# Altium project RaspberryPi_ComputeModule3.PrjPCB (part 2 of 2)

## Sheet RP_ComputeModule3_rev.3.0_BootSelector.SchDoc
size A4 portrait
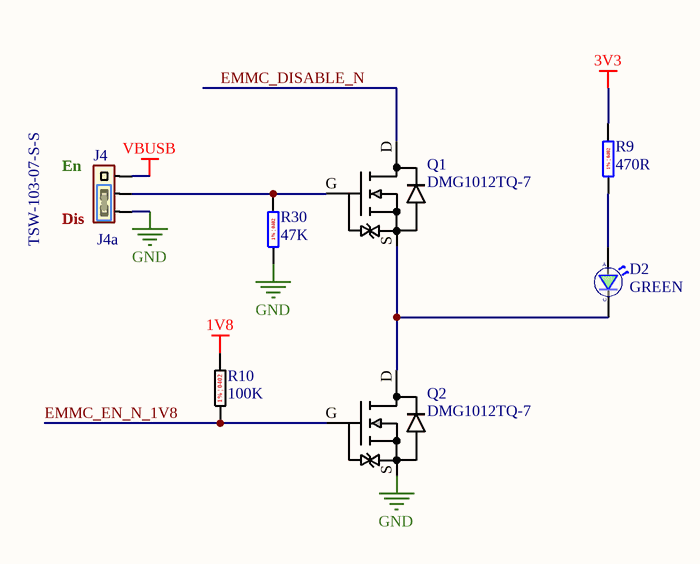
[diagram p5: RP_ComputeModule3_rev.3.0_BootSelector.SchDoc]

### Parts
D2  GREEN  [ROHM 0603 LED]
J4  TSW-103-07-S-S  [Samtec TSW-103-07-S-S]
J4a  Jumper  [Kobiconn 151-8011-E (Blue)]  (value not drawn)
Q1  DMG1012TQ-7  [Diodes SOT523]
Q2  DMG1012TQ-7  [Diodes SOT523]
R9  470R  [Vishay RES0402]
R10  100K  [RES0402]
R30  47K  [Vishay Beyschlag MCS0402]

### Nets
1V8: R10.1
3V3: R9.1
GND: J4.1 Q2.S R30.2
VBUSB: J4.3
EMMC_DISABLE_N: Q1.D
EMMC_EN_N_1V8: Q2.G R10.2
NetD2_A: D2.A R9.2
NetD2_C: D2.C Q1.S Q2.D
NetJ4_2: J4.2 Q1.G R30.1

### Notes on the sheet
- En
- Dis
- (in symbol MCS04020C4700FE000) 1% | 0402
- (in symbol MCS04020C4702FE000) 1% | 0402
- (in symbol SG73P1ETTP1003F) 1% | 0402

### Library data of the parts
D2 = SML-D12M8WT86: LED GREEN DIFFUSED 0603 SMD; Manufacturer: Rohm; Colour: Green,Yellow; Lens Colour: White,Clear,Diffused; Lens Style: Diffused,Colorless,Rectangular; Forward Current: 20mA; Forward Voltage: 2.2V; Luminous Intensity: 25mcd; Dominant Wavelength: 572nm; Number of LEDs: 1; Viewing Angle: 160°; Supplier 1: Mouser; Manufacturer Part Number: SML-D12M8WT86; Stock 1: 109326; Pricing 1: 1=0.32, 10=0.216, 50=0.216, 100=0.09, 1000=0.062, 10000=0.041 (USD); Mount: Surface Mount; Case/Package: 0603; Number of Pins: 2; Case Code (Metric): 1608; Case Code (Imperial): 0603; Min Operating Temperature: -40°C; Max Operating Temperature: 85°C; Packaging: Tape and Reel; Wavelength: 572nm; Illumination Colour: Green; Package Quantity: 1; Test Current: 20mA; Lens Transparency: Diffused; Length: 1.6mm; Height: 0.65mm; Width: 0.8mm; Radiation Hardening: No; REACH SVHC: Unknown; Lead Free: Lead Free; ComponentLink1URL: https://datasheet.ciiva.com/11774/0900766b80df3ada-11774260.pdf; ComponentLink1Description: https://datasheet.ciiva.com/11774/0900766b80df3ada-11774260.pdf; ComponentLink2URL: https://datasheet.ciiva.com/3161/sml-d1-3161419.pdf; ComponentLink2Description: https://datasheet.ciiva.com/3161/sml-d1-3161419.pdf; ComponentLink3URL: https://datasheet.ciiva.com/2110/sml-d1-2110396.pdf; ComponentLink3Description: https://datasheet.ciiva.com/2110/sml-d1-2110396.pdf; ComponentLink4URL: https://datasheet.ciiva.com/2110/sml-d1-2110397.pdf; ComponentLink4Description: https://datasheet.ciiva.com/2110/sml-d1-2110397.pdf; ComponentLink5URL: https://datasheet.ciiva.com/2110/sml-d1-2110398.pdf; ComponentLink5Description: https://datasheet.ciiva.com/2110/sml-d1-2110398.pdf
J4 = TSW-103-07-S-S: Conn Unshrouded Header HDR 3 POS 2.54mm Solder ST Thru-Hole Bulk; Manufacturer: Samtec; Number of Contacts: 3; Gender: Male; Max Current Rating: 7.6A; Max Voltage Rating (AC): 550V; Connector Type: Male Pin; Supplier 1: Digi-Key; Manufacturer Part Number: TSW-103-07-S-S; Stock 1: 950; Pricing 1: 1=1.22, 10=1.089, 100=0.8965, 500=0.70868, 1000=0.60836, 5000=0.555, 10000=0.53365 (USD); Mount: Through Hole; Contact Plating: Nickel,Gold; Contact Material: Bronze; Housing Colour: Black; Housing Material: Polyester; Colour: Black; Min Operating Temperature: -55°C; Max Operating Temperature: 125°C; Number of Rows: 1; Termination: Solder; Packaging: Bulk; Orientation: Straight; Number of Positions: 3; Package Quantity: 1; Length: 7.62mm; Pitch: 2.54mm; Depth: 2.54mm; Contact Mating Length: 0.23inch; Width: 2.54mm; Radiation Hardening: No; REACH SVHC: No SVHC; Lead Free: Lead Free; ComponentLink1URL: https://datasheet.ciiva.com/16733/htsw-th-16733894.pdf; ComponentLink1Description: https://datasheet.ciiva.com/16733/htsw-th-16733894.pdf; ComponentLink2URL: https://datasheet.ciiva.com/48561/htsw-th-48561433.pdf; ComponentLink2Description: https://datasheet.ciiva.com/48561/htsw-th-48561433.pdf; ComponentLink3URL: https://datasheet.ciiva.com/6887/tsw-xxx-xx-xxx-x-xx-xxx-mkt-6887228.pdf; ComponentLink3Description: https://datasheet.ciiva.com/6887/tsw-xxx-xx-xxx-x-xx-xxx-mkt-6887228.pdf
J4a = 151-8011-E: Headers & Wire Housings MINI JUMPER GF 6.0MM CLOSE TYPE BLUE; Manufacturer: Kobiconn; Number of Positions: 2; Pitch: 2.54mm; Supplier 1: Mouser; Manufacturer Part Number: 151-8011-E; Stock 1: 0; Contact Gender: Male; Package Quantity: 2000; ComponentLink1URL: https://datasheet.ciiva.com/5162/kc-301174-5162989.pdf; ComponentLink1Description: https://datasheet.ciiva.com/5162/kc-301174-5162989.pdf
Q1 Q2 = DMG1012TQ-7: MOSFET NCH 20V 630MA SOT523; Manufacturer: Diodes; Rds On Max: 400mR; Input Capacitance: 60.67pF; Max Power Dissipation: 280mW; Supplier 1: Mouser; Manufacturer Part Number: DMG1012TQ-7; Stock 1: 11314; Pricing 1: 1=0.34, 10=0.225, 50=0.225, 100=0.094, 1000=0.064, 10000=0.043 (USD); Mount: Surface Mount; Case/Package: SOT-523; Number of Pins: 3; Min Operating Temperature: -55°C; Max Operating Temperature: 150°C; Packaging: Tape and Reel; Drain to Source Voltage (Vdss): 20V; Continuous Drain Current (ID): 630mA; ComponentLink1URL: http://www.mouser.com/ds/2/115/ds31783-892575.pdf; ComponentLink1Description: http://www.mouser.com/ds/2/115/ds31783-892575.pdf; ComponentLink2URL: https://www.diodes.com/assets/Datasheets/ds31783.pdf; ComponentLink2Description: https://www.diodes.com/assets/Datasheets/ds31783.pdf
R9 = MCS04020C4700FE000: RES SMD 470 OHM 1% 1/10W 0402; Manufacturer: Vishay BCcomponents; Temperature Coefficient: 50ppm/°C; Max Power Dissipation: 100mW; Supplier 1: Digi-Key; Manufacturer Part Number: MCS04020C4700FE000; Stock 1: 98990; Pricing 1: 1=0.3, 10=0.254, 100=0.0993, 1000=0.04158, 2500=0.03812, 5000=0.03465 (USD); Case/Package: 0402; Contact Plating: Tin; Min Operating Temperature: -55°C; Max Operating Temperature: 125°C; Resistance: 470R; Tolerance: 1%; Composition: Thin Film; Packaging: Tape and Reel; Package Quantity: 10000; Number of Terminations: 2; Military Standard: Not; Length: 0.039inch; Height: 0.015inch; Width: 0.02inch; Depth: 0.5mm; Radiation Hardening: No; Lead Free: Lead Free; ComponentLink1URL: https://datasheet.ciiva.com/16892/mc-pro-16892843.pdf; ComponentLink1Description: https://datasheet.ciiva.com/16892/mc-pro-16892843.pdf; ComponentLink2URL: https://datasheet.ciiva.com/2569/mc-pro-2569740.pdf; ComponentLink2Description: https://datasheet.ciiva.com/2569/mc-pro-2569740.pdf; ComponentLink3URL: https://datasheet.ciiva.com/8901/mc-pro-8901326.pdf; ComponentLink3Description: https://datasheet.ciiva.com/8901/mc-pro-8901326.pdf
R10 = SG73P1ETTP1003F: Thick Film Resistors - SMD 0.125W 100Kohm 1% 200ppm; Manufacturer: KOA Speer; Resistance: 100kR; Power Rating: 125mW; Voltage Rating: 200V; Temperature Coefficient: 200ppm/°C; Voltage Rating (DC): 50V; Supplier 1: Mouser; Manufacturer Part Number: SG73P1ETTP1003F; Stock 1: 17094; Pricing 1: 1=0.24, 10=0.24, 50=0.053, 100=0.041, 1000=0.03, 10000=0.018 (USD); Case/Package: 0402; Case Code (Imperial): 0402; Case Code (Metric): 1005; Min Operating Temperature: -55°C; Max Operating Temperature: 155°C; Tolerance: 1%; Packaging: Tape and Reel; Termination: SMD/SMT; ComponentLink1URL: https://datasheet.ciiva.com/5567/sg73-5567782.pdf; ComponentLink1Description: https://datasheet.ciiva.com/5567/sg73-5567782.pdf
R30 = MCS04020C4702FE000: Res Thin Film 0402 47K Ohm 1% 1/16W ±50ppm/C Molded SMD Paper T/R; Manufacturer: Vishay BCcomponents; Resistance: 47kR; Temperature Coefficient: 50ppm/°C; Power Rating: 100mW; Voltage Rating: 50V; Supplier 1: Mouser; Manufacturer Part Number: MCS04020C4702FE000; Stock 1: 7724; Pricing 1: 1=0.11, 10=0.11, 50=0.076, 100=0.065, 1000=0.054, 10000=0.04 (USD); Case/Package: 0402; Contact Plating: Tin; Case Code (Metric): 1005; Case Code (Imperial): 0402; Min Operating Temperature: -55°C; Max Operating Temperature: 125°C; Tolerance: 1%; Composition: Thin Film; Packaging: Tape and Reel; Military Standard: Not; Voltage Rating (DC): 50V; Length: 1mm; Depth: 0.5mm; Width: 500um; Radiation Hardening: No; REACH SVHC: No SVHC; Lead Free: Lead Free; ComponentLink1URL: https://datasheet.ciiva.com/17178/mc-pro-17178488.pdf; ComponentLink1Description: https://datasheet.ciiva.com/17178/mc-pro-17178488.pdf; ComponentLink2URL: https://datasheet.ciiva.com/8900/mc-pro-8900138.pdf; ComponentLink2Description: https://datasheet.ciiva.com/8900/mc-pro-8900138.pdf

## Sheet RP_ComputeModule3_rev.3.0_Displays.SchDoc
size A4 portrait
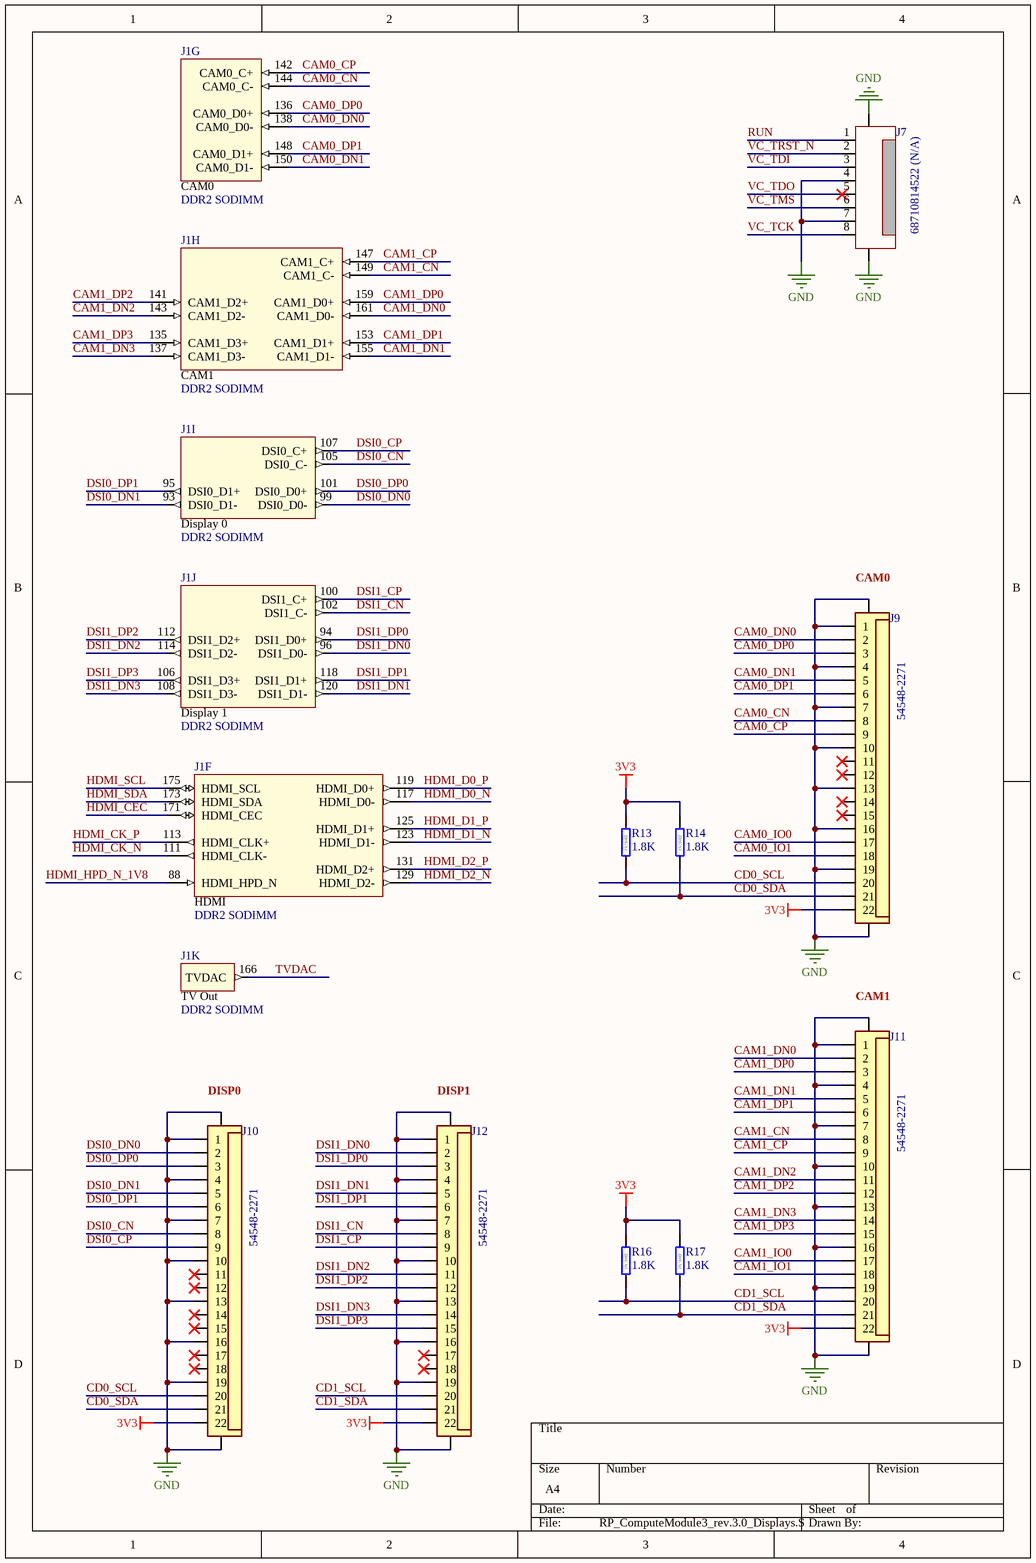
[diagram p6: RP_ComputeModule3_rev.3.0_Displays.SchDoc]

### Parts
J1  DDR2 SODIMM  [TE 1473005-4 (DDR2 SO-DIMM)]  (parts F,G,H,I,J,K of 14)
J7  68710814522 (N/A)  [WE 68710814522 N/A]  (no BOM)
J9  54548-2271  [Molex 54548-2271]
J10  54548-2271  [Molex 54548-2271]
J11  54548-2271  [Molex 54548-2271]
J12  54548-2271  [Molex 54548-2271]
R13  1.8K  [RES0402]
R14  1.8K  [RES0402]
R16  1.8K  [RES0402]
R17  1.8K  [RES0402]

### Nets
3V3: J9.22 J10.22 J11.22 J12.22 R13.1 R14.1 R16.1 R17.1
GND: J7.4 J7.7 J7.9 J7.10 J9.1 J9.4 J9.7 J9.10 J9.13 J9.16 J9.19 J9.G1 J9.G2 J10.1 J10.4 J10.7 J10.10 J10.13 J10.16 J10.19 J10.G1 J10.G2 J11.1 J11.4 J11.7 J11.10 J11.13 J11.16 J11.19 J11.G1 J11.G2 J12.1 J12.4 J12.7 J12.10 J12.13 J12.16 J12.19 J12.G1 J12.G2
CAM0_CN: J1.144(CAM0_C-) J9.8
CAM0_CP: J1.142(CAM0_C+) J9.9
CAM0_DN0: J1.138(CAM0_D0-) J9.2
CAM0_DN1: J1.150(CAM0_D1-) J9.5
CAM0_DP0: J1.136(CAM0_D0+) J9.3
CAM0_DP1: J1.148(CAM0_D1+) J9.6
CAM0_IO0: J9.17
CAM0_IO1: J9.18
CAM1_CN: J1.149(CAM1_C-) J11.8
CAM1_CP: J1.147(CAM1_C+) J11.9
CAM1_DN0: J1.161(CAM1_D0-) J11.2
CAM1_DN1: J1.155(CAM1_D1-) J11.5
CAM1_DN2: J1.143(CAM1_D2-) J11.11
CAM1_DN3: J1.137(CAM1_D3-) J11.14
CAM1_DP0: J1.159(CAM1_D0+) J11.3
CAM1_DP1: J1.153(CAM1_D1+) J11.6
CAM1_DP2: J1.141(CAM1_D2+) J11.12
CAM1_DP3: J1.135(CAM1_D3+) J11.15
CAM1_IO0: J11.17
CAM1_IO1: J11.18
CD0_SCL: J9.20 J10.20 R13.2
CD0_SDA: J9.21 J10.21 R14.2
CD1_SCL: J11.20 J12.20 R16.2
CD1_SDA: J11.21 J12.21 R17.2
DSI0_CN: J1.105(DSI0_C-) J10.8
DSI0_CP: J1.107(DSI0_C+) J10.9
DSI0_DN0: J1.99(DSI0_D0-) J10.2
DSI0_DN1: J1.93(DSI0_D1-) J10.5
DSI0_DP0: J1.101(DSI0_D0+) J10.3
DSI0_DP1: J1.95(DSI0_D1+) J10.6
DSI1_CN: J1.102(DSI1_C-) J12.8
DSI1_CP: J1.100(DSI1_C+) J12.9
DSI1_DN0: J1.96(DSI1_D0-) J12.2
DSI1_DN1: J1.120(DSI1_D1-) J12.5
DSI1_DN2: J1.114(DSI1_D2-) J12.11
DSI1_DN3: J1.108(DSI1_D3-) J12.14
DSI1_DP0: J1.94(DSI1_D0+) J12.3
DSI1_DP1: J1.118(DSI1_D1+) J12.6
DSI1_DP2: J1.112(DSI1_D2+) J12.12
DSI1_DP3: J1.106(DSI1_D3+) J12.15
HDMI_CEC: J1.171(HDMI_CEC)
HDMI_CK_N: J1.111(HDMI_CLK-)
HDMI_CK_P: J1.113(HDMI_CLK+)
HDMI_D0_N: J1.117(HDMI_D0-)
HDMI_D0_P: J1.119(HDMI_D0+)
HDMI_D1_N: J1.123(HDMI_D1-)
HDMI_D1_P: J1.125(HDMI_D1+)
HDMI_D2_N: J1.129(HDMI_D2-)
HDMI_D2_P: J1.131(HDMI_D2+)
HDMI_HPD_N_1V8: J1.88(HDMI_HPD_N)
HDMI_SCL: J1.175(HDMI_SCL)
HDMI_SDA: J1.173(HDMI_SDA)
RUN: J7.1
TVDAC: J1.166(TVDAC)
VC_TCK: J7.8
VC_TDI: J7.3
VC_TDO: J7.5
VC_TMS: J7.6
VC_TRST_N: J7.2

Not connected (* = marked no-connect by the designer): J9 11* 12* 14* 15*; J10 11* 12* 14* 15* 17* 18*; J12 17* 18*

### Notes on the sheet
- (near J9) CAM0
- (near J11) CAM1
- (near J10) DISP0
- (near J12) DISP1
- (in symbol 1473005-4, part F) HDMI
- (in symbol 1473005-4, part G) CAM0
- (in symbol 1473005-4, part H) CAM1
- (in symbol 1473005-4, part I) Display 0
- (in symbol 1473005-4, part J) Display 1
- (in symbol 1473005-4, part K) TV Out
- (in symbol RK73H1ETTP1801F) 1% | 0402

### Library data of the parts
J1 = 1473005-4: TE CONNECTIVITY / AMP         1473005-4             SOCKET IC, DIMM, DDR2, 1.8V, 200WAY; Number of Contacts: 200; Memory Type: SDRAM,DDR; Insulation Resistance: 250MR; PCB Mount Retention: With; Gender: Female; Contact Current Rating: 500mA; Circuit Application: Power; Connector System: Cable-to-Board; Sealable: No (Without); Pitch: 0.6mm; Row Spacing: 0.244inch; Stack Height: 5.2mm; Supplier 1: Digi-Key; Manufacturer: TE Connectivity; Manufacturer Part Number: 1473005-4; Stock 1: 3804; Pricing 1: 1=3.9, 10=3.744, 25=3.432, 50=3.276, 100=3.12, 250=2.73, 500=2.652, 1000=2.262, 2500=2.106 (USD); Mount: Surface Mount; Number of Pins: 200; Contact Material: Copper Alloy; Contact Plating: Gold; Housing Colour: Black; Housing Material: Thermoplastic; Insulation Material: Thermoplastic; Min Operating Temperature: -67°C; Max Operating Temperature: 185°C; Number of Rows: 2; Orientation: Right Angle; Termination: Solder; Packaging: Tray; Package Quantity: 20; Number of Positions: 200; Voltage Rating: 1.8V; Connector Type: Socket; Length: 71.5mm; Depth: 26mm; Radiation Hardening: No; ELV: Compliant; Flammability Rating: UL94 V-0; Lead Free: Lead Free; REACH SVHC: No SVHC; ComponentLink1URL: https://datasheet.ciiva.com/682/eng-cd-1473005-j2-682720.pdf; ComponentLink1Description: https://datasheet.ciiva.com/682/eng-cd-1473005-j2-682720.pdf; ComponentLink2URL: https://datasheet.ciiva.com/15171/getdatasheetpartid-99150-15171488.pdf; ComponentLink2Description: https://datasheet.ciiva.com/15171/getdatasheetpartid-99150-15171488.pdf; ComponentLink3URL: https://datasheet.ciiva.com/1105/582309-1105221.pdf; ComponentLink3Description: https://datasheet.ciiva.com/1105/582309-1105221.pdf; ComponentLink4URL: https://datasheet.ciiva.com/682/eng-cd-1473005-j2-682726.pdf; ComponentLink4Description: https://datasheet.ciiva.com/682/eng-cd-1473005-j2-682726.pdf; ComponentLink5URL: https://datasheet.ciiva.com/14156/04821302-14156311.pdf; ComponentLink5Description: https://datasheet.ciiva.com/14156/04821302-14156311.pdf; ComponentLink6URL: https://datasheet.ciiva.com/3136/eng-cd-1473005-j-3136060.pdf; ComponentLink6Description: https://datasheet.ciiva.com/3136/eng-cd-1473005-j-3136060.pdf; ComponentLink7URL: https://datasheet.ciiva.com/16380/eng-cd-1473005-j-16380909.pdf; ComponentLink7Description: https://datasheet.ciiva.com/16380/eng-cd-1473005-j-16380909.pdf; ComponentLink8URL: https://datasheet.ciiva.com/16651/eng-cd-1473005-j-16651646.pdf; ComponentLink8Description: https://datasheet.ciiva.com/16651/eng-cd-1473005-j-16651646.pdf
J7 = 68710814522_N/A: CONN FPC BOTTOM 8POS 0.50MM R/A; Manufacturer: Wurth Electronics; Actuator Material: Polymer,Liquid Crystal Polymer; Current Rating: 500mA; Voltage Rating: 50V; Number of Positions: 8; Insulation Resistance: 100MR; Gender: Male; Pitch: 0.5mm; Supplier 1: Mouser; Manufacturer Part Number: 68710814522; Stock 1: 2190; Pricing 1: 1=1.02, 10=0.991, 50=0.923, 100=0.854, 1000=0.718, 10000=0.635 (USD); Mount: Surface Mount; Contact Material: Bronze,Tin; Contact Plating: Tin; Housing Material: Liquid Crystal Polymer; Min Operating Temperature: -25°C; Max Operating Temperature: 85°C; Number of Rows: 1; Packaging: Tape and Reel; Package Quantity: 2000; Contact Location: Bottom; Termination: SMD/SMT; Number of Contacts: 8; Orientation: Straight; Length: 10.4mm; Width: 2.1mm; REACH SVHC: Unknown; Flammability Rating: UL94 V-0; ComponentLink1URL: https://datasheet.ciiva.com/670/6871xx14522-670726.pdf; ComponentLink1Description: https://datasheet.ciiva.com/670/6871xx14522-670726.pdf; ComponentLink2URL: https://datasheet.ciiva.com/670/6871xx14522-670727.pdf; ComponentLink2Description: https://datasheet.ciiva.com/670/6871xx14522-670727.pdf; ComponentLink3URL: https://datasheet.ciiva.com/670/6871xx14522-670728.pdf; ComponentLink3Description: https://datasheet.ciiva.com/670/6871xx14522-670728.pdf; ComponentLink4URL: https://datasheet.ciiva.com/14153/6871xx14522-eng-datasheet-14153886.pdf; ComponentLink4Description: https://datasheet.ciiva.com/14153/6871xx14522-eng-datasheet-14153886.pdf; ComponentLink5URL: https://datasheet.ciiva.com/29318/709082-da-01-en-smd-zif-stecker-90grad-kontakte-unten-8-29318044.pdf; ComponentLink5Description: https://datasheet.ciiva.com/29318/709082-da-01-en-smd-zif-stecker-90grad-kontakte-unten-8-29318044.pdf
J9-J12 = 0545482271: Conn FFC/FPC Connector SKT 22 POS 0.5mm Solder RA SMD Easy-On™ T/R; Manufacturer: Molex; Actuator Material: Polyphenylene; Voltage Rating: 50V; Current Rating: 500mA; Number of Positions: 22; Contact Resistance: 40mR; Wire/Cable Type: Straight; Supplier 1: Mouser; Manufacturer Part Number: 0545482271; Stock 1: 2798; Pricing 1: 1=2.25, 10=1.98, 50=1.98, 100=1.8, 1000=1.31, 10000=1.17 (USD); Mount: Surface Mount; Contact Material: Bronze; Contact Plating: Nickel,Gold; Housing Material: Polymer; Min Operating Temperature: -20°C; Max Operating Temperature: 85°C; Package Quantity: 1; Packaging: Tape and Reel; Number of Rows: 1; Termination: Solder; Orientation: Right Angle; Number of Contacts: 22; Length: 16.2mm; Pitch: 0.5mm; Depth: 5mm; Flammability Rating: UL94 V-0; ComponentLink1URL: https://datasheet.ciiva.com/3926/187910545482271-ffc-fpc-nectors-3926715.pdf; ComponentLink1Description: https://datasheet.ciiva.com/3926/187910545482271-ffc-fpc-nectors-3926715.pdf; ComponentLink2URL: https://datasheet.ciiva.com/3112/0545482271-ffc-fpc-connectors-3112285.pdf; ComponentLink2Description: https://datasheet.ciiva.com/3112/0545482271-ffc-fpc-connectors-3112285.pdf; ComponentLink3URL: https://datasheet.ciiva.com/6944/545482671-sd-6944776.pdf; ComponentLink3Description: https://datasheet.ciiva.com/6944/545482671-sd-6944776.pdf; ComponentLink4URL: https://datasheet.ciiva.com/6944/545482671-sd-6944780.pdf; ComponentLink4Description: https://datasheet.ciiva.com/6944/545482671-sd-6944780.pdf
R13 R14 R16 R17 = RK73H1ETTP1801F: Thick Film Resistors - SMD 1.8K OHM 1%; Manufacturer: KOA Speer; Resistance: 1.8kR; Power Rating: 63mW; Voltage Rating: 50V; Temperature Coefficient: 100ppm/°C; Supplier 1: Mouser; Manufacturer Part Number: RK73H1ETTP1801F; Stock 1: 3595; Pricing 1: 1=0.11, 10=0.027, 50=0.027, 100=0.007, 1000=0.005, 10000=0.004 (USD); Case/Package: 0402; Case Code (Imperial): 0402; Case Code (Metric): 1005; Min Operating Temperature: -55°C; Max Operating Temperature: 155°C; Packaging: Tape and Reel; Tolerance: 1%; Package Quantity: 10000; Composition: Thick Film; Termination: SMD/SMT; Military Standard: Not; Length: 1mm; Height: 0.35mm; Width: 0.5mm; Depth: 0.5mm; Lead Free: Lead Free; ComponentLink1URL: https://datasheet.ciiva.com/5553/rk73h-5715-5553193.pdf; ComponentLink1Description: https://datasheet.ciiva.com/5553/rk73h-5715-5553193.pdf

## Sheet RP_ComputeModule3_rev.3.0_Mechanics.SchDoc
size A4 portrait
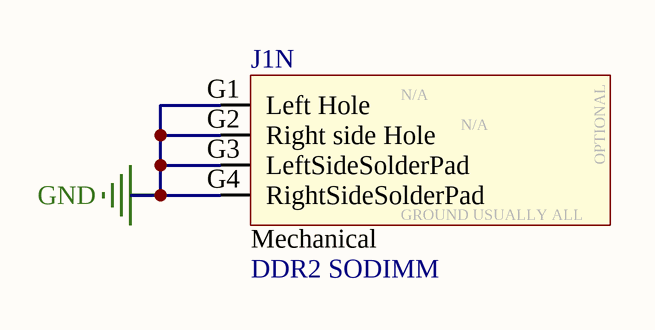
[diagram p7: RP_ComputeModule3_rev.3.0_Mechanics.SchDoc]

### Parts
J1  DDR2 SODIMM  [TE 1473005-4 (DDR2 SO-DIMM)]  (part N of 14)

### Nets
GND: J1.G1(Left_Hole) J1.G2(Right_side_Hole) J1.G3(LeftSideSolderPad) J1.G4(RightSideSolderPad)

### Notes on the sheet
- (in symbol 1473005-4, part N) N/A; OPTIONAL; GROUND USUALLY ALL; Mechanical

### Library data of the parts
J1 = 1473005-4: as J1 on sheet RP_ComputeModule3_rev.3.0_Displays; Supplier 1: Digi-Key; Manufacturer: TE Connectivity; Manufacturer Part Number: 1473005-4; Stock 1: 3804; Pricing 1: 1=3.9, 10=3.744, 25=3.432, 50=3.276, 100=3.12, 250=2.73, 500=2.652, 1000=2.262, 2500=2.106 (USD); Mount: Surface Mount; Number of Pins: 200; Contact Material: Copper Alloy; Contact Plating: Gold; Housing Colour: Black; Housing Material: Thermoplastic; Insulation Material: Thermoplastic; Min Operating Temperature: -67°C; Max Operating Temperature: 185°C; Number of Rows: 2; Orientation: Right Angle; Termination: Solder; Packaging: Tray; Package Quantity: 20; Number of Positions: 200; Voltage Rating: 1.8V; Connector Type: Socket; Length: 71.5mm; Depth: 26mm; Radiation Hardening: No; ELV: Compliant; Flammability Rating: UL94 V-0; Lead Free: Lead Free; REACH SVHC: No SVHC; ComponentLink1URL: https://datasheet.ciiva.com/682/eng-cd-1473005-j2-682720.pdf; ComponentLink1Description: https://datasheet.ciiva.com/682/eng-cd-1473005-j2-682720.pdf; ComponentLink2URL: https://datasheet.ciiva.com/15171/getdatasheetpartid-99150-15171488.pdf; ComponentLink2Description: https://datasheet.ciiva.com/15171/getdatasheetpartid-99150-15171488.pdf; ComponentLink3URL: https://datasheet.ciiva.com/1105/582309-1105221.pdf; ComponentLink3Description: https://datasheet.ciiva.com/1105/582309-1105221.pdf; ComponentLink4URL: https://datasheet.ciiva.com/682/eng-cd-1473005-j2-682726.pdf; ComponentLink4Description: https://datasheet.ciiva.com/682/eng-cd-1473005-j2-682726.pdf; ComponentLink5URL: https://datasheet.ciiva.com/14156/04821302-14156311.pdf; ComponentLink5Description: https://datasheet.ciiva.com/14156/04821302-14156311.pdf; ComponentLink6URL: https://datasheet.ciiva.com/3136/eng-cd-1473005-j-3136060.pdf; ComponentLink6Description: https://datasheet.ciiva.com/3136/eng-cd-1473005-j-3136060.pdf; ComponentLink7URL: https://datasheet.ciiva.com/16380/eng-cd-1473005-j-16380909.pdf; ComponentLink7Description: https://datasheet.ciiva.com/16380/eng-cd-1473005-j-16380909.pdf; ComponentLink8URL: https://datasheet.ciiva.com/16651/eng-cd-1473005-j-16651646.pdf; ComponentLink8Description: https://datasheet.ciiva.com/16651/eng-cd-1473005-j-16651646.pdf

## Sheet RP_ComputeModule3_rev.3.0_USB.SchDoc
size A4 portrait
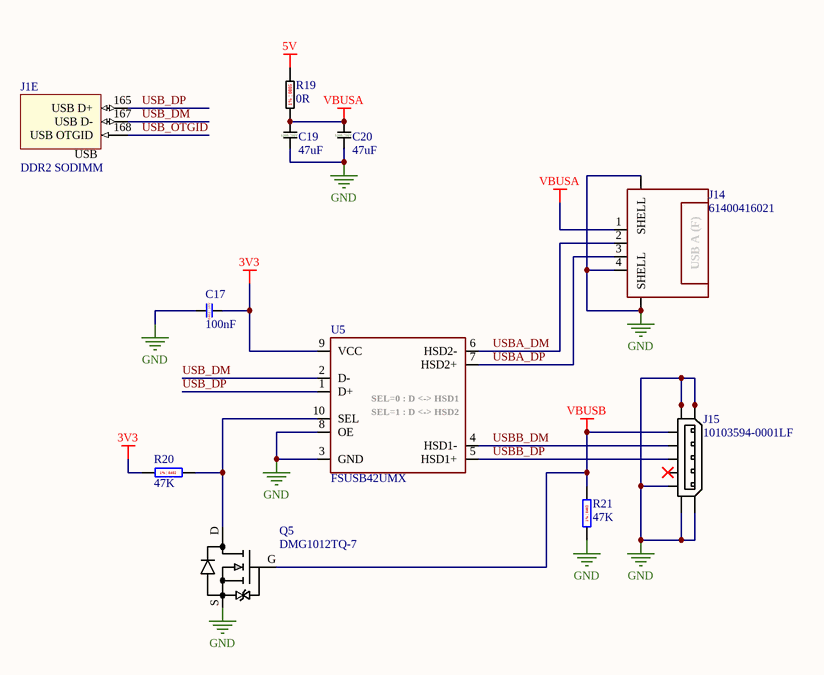
[diagram p8: RP_ComputeModule3_rev.3.0_USB.SchDoc]

### Parts
C17  100nF  [GJM 0402 C]
C19  47uF  [MURATA C1206 / CAPC3216X94N]
C20  47uF  [MURATA C1206 / CAPC3216X94N]
J1  DDR2 SODIMM  [TE 1473005-4 (DDR2 SO-DIMM)]  (part E of 14)
J14  61400416021  [WE USB connector 61400416021]
J15  10103594-0001LF  [FCI_10103594-0001LF]
Q5  DMG1012TQ-7  [Diodes SOT523]
R19  0R  [YAGEO RES0402]
R20  47K  [Vishay Beyschlag MCS0402]
R21  47K  [Vishay Beyschlag MCS0402]
U5  FSUSB42UMX  [Fairchild/OnSemi - UMLP (FSUSB42)]

### Nets
3V3: C17.1 R20.2 U5.9(VCC)
5V: R19.1
GND: C17.2 C19.1 C20.1 J14.4 J14.SHELL J14.SHELL2(SHELL) J15.1 J15.6 J15.7 J15.8 J15.9 J15.10 J15.11 Q5.S R21.2 U5.3(GND) U5.8(OE)
VBUSA: C19.2 C20.2 J14.1 R19.2
VBUSB: J15.5 Q5.G R21.1
USB_DM: J1.167(USB_D-) U5.2(D-)
USB_DP: J1.165(USB_D+) U5.1(D+)
USB_OTGID: J1.168(USB_OTGID)
USBA_DM: J14.2 U5.6(HSD2-)
USBA_DP: J14.3 U5.7(HSD2+)
USBB_DM: J15.4 U5.4(HSD1-)
USBB_DP: J15.3 U5.5(HSD1+)
NetQ5_D: Q5.D R20.1 U5.10(SEL)

Not connected (* = marked no-connect by the designer): J15 2*

### Notes on the sheet
- (in symbol 1473005-4, part E) USB
- (in symbol 61400416021) USB A (F)
- (in symbol AC0805FR-070RL) 1% | 0805
- (in symbol C3216JB1C476M160AB) 1206 | 16V
- (in symbol FSUSB42UMX) SEL=0 : D <-> HSD1; SEL=1 : D <-> HSD2
- (in symbol GRM155R71A104JA01D) 0402 | 10V
- (in symbol MCS04020C4702FE000) 1% | 0402

### Library data of the parts
C17 = GRM155R71A104JA01D: Multilayer Ceramic Capacitors MLCC - SMD/SMT 0402 0.1uF 10volts 5%; Manufacturer: Murata Electronics; Type: Chip Monolithic Ceramic Capacitor; Voltage Rating DC: 10 VDC; Capacitance - pF: 100000 pF; Dielectric: X7R; Supplier 1: Mouser; Manufacturer Part Number: GRM155R71A104JA01D; RoHS: RoHS Compliant; Category: Multilayer Ceramic Capacitors MLCC - SMD/SMT; Stock 1: 376; Pricing 1: 1=0.100, 10=0.024, 100=0.011, 500=0.008, 1000=0.006, 5000=0.005, 10000=0.004 (USD); Capacitance: 0.1 uF; Height: 0.5 mm; Length: 1 mm; Package / Case: 0402 (1005 metric); Packaging: Cut Tape; Product: General Type MLCCs; Series: GRM; Termination Style: SMD/SMT; Tolerance: 5 %; Width: 0.5 mm; Brand: Murata Electronics; Capacitance - nF: 100 nF; Case Code - in: 0402; Case Code - mm: 1005; Maximum Operating Temperature: + 125 C; Minimum Operating Temperature: - 55 C; Standard Pack Qty: 10000; RoHS - Mouser: Y; Minimum Order Quantity: 1; Reeling: True; ComponentLink1URL: https://www.mouser.com/ds/2/281/c02e-2905.pdf; ComponentLink1Description: https://www.mouser.com/ds/2/281/c02e-2905.pdf
C19 C20 = C3216JB1C476M160AB: 47µF ±20% 16V JB Ceramic Capacitor -25°C ~ 85°C Surface Mount, MLCC 1206 (3216 Metric) 0.126" L x 0.063" W (3.20mm x 1.60mm); Manufacturer: TDK; Supplier 1: Digi-Key; Manufacturer Part Number: C3216JB1C476M160AB; Stock 1: 203837; Pricing 1: 1=1.2, 10=0.949, 100=0.7116, 500=0.53762, 1000=0.47438 (USD); Mount: Surface Mount; Case/Package: 1206; Case Code (Metric): 3216; Case Code (Imperial): 1206; Dielectric Material: Ceramic; Min Operating Temperature: -25°C; Max Operating Temperature: 85°C; Package Quantity: 1; Packaging: Tape and Reel; Capacitance: 47uF; Tolerance: 20%; Voltage Rating: 16V; Termination: SMD/SMT; Composition: Ceramic; Voltage Rating (DC): 16V; Length: 0.126inch; Height: 1.6mm; Width: 0.063inch; Thickness: 0.069inch; Lead Free: Lead Free; ComponentLink1URL: https://product.tdk.com/en/products/common/pdf/mlcc_partnumber_description.pdf; ComponentLink1Description: https://product.tdk.com/en/products/common/pdf/mlcc_partnumber_description.pdf; ComponentLink2URL: http://product.tdk.com/en/catalog/datasheets/mlcc_commercial_general_en.pdf; ComponentLink2Description: http://product.tdk.com/en/catalog/datasheets/mlcc_commercial_general_en.pdf; ComponentLink3URL: http://www.mouser.com/ds/2/400/lcc_commercial_general_en-837201.pdf; ComponentLink3Description: http://www.mouser.com/ds/2/400/lcc_commercial_general_en-837201.pdf
J1 = 1473005-4: as J1 on sheet RP_ComputeModule3_rev.3.0_Displays; Supplier 1: Digi-Key; Manufacturer: TE Connectivity; Manufacturer Part Number: 1473005-4; Stock 1: 3804; Pricing 1: 1=3.9, 10=3.744, 25=3.432, 50=3.276, 100=3.12, 250=2.73, 500=2.652, 1000=2.262, 2500=2.106 (USD); Mount: Surface Mount; Number of Pins: 200; Contact Material: Copper Alloy; Contact Plating: Gold; Housing Colour: Black; Housing Material: Thermoplastic; Insulation Material: Thermoplastic; Min Operating Temperature: -67°C; Max Operating Temperature: 185°C; Number of Rows: 2; Orientation: Right Angle; Termination: Solder; Packaging: Tray; Package Quantity: 20; Number of Positions: 200; Voltage Rating: 1.8V; Connector Type: Socket; Length: 71.5mm; Depth: 26mm; Radiation Hardening: No; ELV: Compliant; Flammability Rating: UL94 V-0; Lead Free: Lead Free; REACH SVHC: No SVHC; ComponentLink1URL: https://datasheet.ciiva.com/682/eng-cd-1473005-j2-682720.pdf; ComponentLink1Description: https://datasheet.ciiva.com/682/eng-cd-1473005-j2-682720.pdf; ComponentLink2URL: https://datasheet.ciiva.com/15171/getdatasheetpartid-99150-15171488.pdf; ComponentLink2Description: https://datasheet.ciiva.com/15171/getdatasheetpartid-99150-15171488.pdf; ComponentLink3URL: https://datasheet.ciiva.com/1105/582309-1105221.pdf; ComponentLink3Description: https://datasheet.ciiva.com/1105/582309-1105221.pdf; ComponentLink4URL: https://datasheet.ciiva.com/682/eng-cd-1473005-j2-682726.pdf; ComponentLink4Description: https://datasheet.ciiva.com/682/eng-cd-1473005-j2-682726.pdf; ComponentLink5URL: https://datasheet.ciiva.com/14156/04821302-14156311.pdf; ComponentLink5Description: https://datasheet.ciiva.com/14156/04821302-14156311.pdf; ComponentLink6URL: https://datasheet.ciiva.com/3136/eng-cd-1473005-j-3136060.pdf; ComponentLink6Description: https://datasheet.ciiva.com/3136/eng-cd-1473005-j-3136060.pdf; ComponentLink7URL: https://datasheet.ciiva.com/16380/eng-cd-1473005-j-16380909.pdf; ComponentLink7Description: https://datasheet.ciiva.com/16380/eng-cd-1473005-j-16380909.pdf; ComponentLink8URL: https://datasheet.ciiva.com/16651/eng-cd-1473005-j-16651646.pdf; ComponentLink8Description: https://datasheet.ciiva.com/16651/eng-cd-1473005-j-16651646.pdf
J14 = 61400416021: USB - A USB 2.0 Receptacle Connector 4 Position Through Hole, Right Angle, Horizontal; Manufacturer: Wurth Electronics; Connector Type: USB,Socket; Number of Contacts: 4; Current Rating: 1A; Voltage Rating: 30V; Number of Ports: 1; Insulation Resistance: 1GR; USB Standard: USB 2.0; Supplier 1: Mouser; Manufacturer Part Number: 61400416021; Stock 1: 1100; Pricing 1: 1=0.99, 10=0.874, 50=0.823, 100=0.739, 1000=0.672, 10000=0.672 (USD); Mount: Through Hole,Horizontal; Contact Plating: Gold; Contact Material: Copper Alloy; Colour: White; Min Operating Temperature: -40°C; Max Operating Temperature: 105°C; Packaging: Tray; Gender: Receptacle; Package Quantity: 60; Number of Positions: 4; Termination: Solder; Orientation: Right Angle; Length: 15.8mm; Width: 14.4mm; REACH SVHC: Unknown; Lead Free: Lead Free; Flammability Rating: UL94 V-0; ComponentLink1URL: https://datasheet.ciiva.com/851/61400416021-851760.pdf; ComponentLink1Description: https://datasheet.ciiva.com/851/61400416021-851760.pdf; ComponentLink2URL: https://datasheet.ciiva.com/1098/1712150-1098928.pdf; ComponentLink2Description: https://datasheet.ciiva.com/1098/1712150-1098928.pdf; ComponentLink3URL: https://datasheet.ciiva.com/4598/61400416021-63715-4598787.pdf; ComponentLink3Description: https://datasheet.ciiva.com/4598/61400416021-63715-4598787.pdf; ComponentLink4URL: https://datasheet.ciiva.com/11731/0900766b81023ab4-11731304.pdf; ComponentLink4Description: https://datasheet.ciiva.com/11731/0900766b81023ab4-11731304.pdf; ComponentLink5URL: https://datasheet.ciiva.com/1100/76585-1100559.pdf; ComponentLink5Description: https://datasheet.ciiva.com/1100/76585-1100559.pdf; ComponentLink6URL: https://datasheet.ciiva.com/14103/4257096-eng-datasheet-14103431.pdf; ComponentLink6Description: https://datasheet.ciiva.com/14103/4257096-eng-datasheet-14103431.pdf; ComponentLink7URL: https://datasheet.ciiva.com/48712/001088207-da-01-en-wr-com-usb-typ-a-61400416021-48712661.pdf; ComponentLink7Description: https://datasheet.ciiva.com/48712/001088207-da-01-en-wr-com-usb-typ-a-61400416021-48712661.pdf
J15 = 10103594-0001LF: USB - micro B USB 2.0 Receptacle Connector 5 Position Surface Mount, Right Angle, Horizontal; Manufacturer: Amphenol FCI; Voltage Rating: 100V; Current Rating: 1.8A; Connector Type: USB,Receptacle; Number of Ports: 1; Insulation Resistance: 1GR; Number of Contacts: 5; USB Standard: USB 2.0; Pitch: 0.65mm; Supplier 1: Mouser; Manufacturer Part Number: 10103594-0001LF; Stock 1: 28662; Pricing 1: 1=0.7, 10=0.522, 50=0.522, 100=0.501, 1000=0.359, 10000=0.294 (USD); Mount: Surface Mount,Horizontal; Contact Plating: Nickel,Gold; Contact Material: Copper,Copper Alloy; Number of Terminals: 5; Housing Material: Thermoplastic; Min Operating Temperature: -55°C; Max Operating Temperature: 85°C; Termination: Solder; Orientation: Right Angle; Gender: Receptacle; Packaging: Tape and Reel; Package Quantity: 1500; Max Voltage Rating (AC): 100V; Length: 8.04mm; Radiation Hardening: No; REACH SVHC: No SVHC; Lead Free: Lead Free; ComponentLink1URL: https://datasheet.ciiva.com/8015/10103594-8015248.pdf; ComponentLink1Description: https://datasheet.ciiva.com/8015/10103594-8015248.pdf; ComponentLink2URL: https://datasheet.ciiva.com/11731/0900766b80ed1ae4-11731328.pdf; ComponentLink2Description: https://datasheet.ciiva.com/11731/0900766b80ed1ae4-11731328.pdf; ComponentLink3URL: https://datasheet.ciiva.com/14618/70236822-14618885.pdf; ComponentLink3Description: https://datasheet.ciiva.com/14618/70236822-14618885.pdf; ComponentLink4URL: https://datasheet.ciiva.com/22654/1469075-22654519.pdf; ComponentLink4Description: https://datasheet.ciiva.com/22654/1469075-22654519.pdf; ComponentLink5URL: https://datasheet.ciiva.com/851/10103594-851115.pdf; ComponentLink5Description: https://datasheet.ciiva.com/851/10103594-851115.pdf; ComponentLink6URL: https://datasheet.ciiva.com/5726/10103594-5726971.pdf; ComponentLink6Description: https://datasheet.ciiva.com/5726/10103594-5726971.pdf; ComponentLink7URL: https://datasheet.ciiva.com/851/10103594-851116.pdf; ComponentLink7Description: https://datasheet.ciiva.com/851/10103594-851116.pdf; ComponentLink8URL: https://datasheet.ciiva.com/851/10103594-851117.pdf; ComponentLink8Description: https://datasheet.ciiva.com/851/10103594-851117.pdf
Q5 = DMG1012TQ-7: as Q1 on sheet RP_ComputeModule3_rev.3.0_BootSelector; Supplier 1: Mouser; Manufacturer Part Number: DMG1012TQ-7; Stock 1: 11314; Pricing 1: 1=0.34, 10=0.225, 50=0.225, 100=0.094, 1000=0.064, 10000=0.043 (USD); Mount: Surface Mount; Case/Package: SOT-523; Number of Pins: 3; Min Operating Temperature: -55°C; Max Operating Temperature: 150°C; Packaging: Tape and Reel; Drain to Source Voltage (Vdss): 20V; Continuous Drain Current (ID): 630mA; ComponentLink1URL: http://www.mouser.com/ds/2/115/ds31783-892575.pdf; ComponentLink1Description: http://www.mouser.com/ds/2/115/ds31783-892575.pdf; ComponentLink2URL: https://www.diodes.com/assets/Datasheets/ds31783.pdf; ComponentLink2Description: https://www.diodes.com/assets/Datasheets/ds31783.pdf
R19 = AC0805FR-070RL: Thick Film Resistors - SMD 1/8W 0.0ohm 1%; Manufacturer: Yageo; Voltage Rating: 150V; Power Rating: 125mW; Resistance: 0mR; Temperature Coefficient: 200ppm/°C; Supplier 1: Mouser; Manufacturer Part Number: AC0805FR-070RL; Stock 1: 1027; Pricing 1: 1=0.16, 10=0.036, 50=0.036, 100=0.012, 1000=0.009, 10000=0.004 (USD); Mount: Surface Mount; Case/Package: 0805; Case Code (Imperial): 0805; Case Code (Metric): 2012; Min Operating Temperature: -55°C; Max Operating Temperature: 155°C; Tolerance: 1%; Packaging: Tape and Reel; Termination: SMD/SMT; Lead Free: Lead Free; ComponentLink1URL: https://datasheet.ciiva.com/12656/pyu-ac-51-rohs-l-2-12656890.pdf; ComponentLink1Description: https://datasheet.ciiva.com/12656/pyu-ac-51-rohs-l-2-12656890.pdf
R20 R21 = MCS04020C4702FE000: as R30 on sheet RP_ComputeModule3_rev.3.0_BootSelector; Supplier 1: Mouser; Manufacturer Part Number: MCS04020C4702FE000; Stock 1: 7724; Pricing 1: 1=0.11, 10=0.11, 50=0.076, 100=0.065, 1000=0.054, 10000=0.04 (USD); Case/Package: 0402; Contact Plating: Tin; Case Code (Metric): 1005; Case Code (Imperial): 0402; Min Operating Temperature: -55°C; Max Operating Temperature: 125°C; Tolerance: 1%; Composition: Thin Film; Packaging: Tape and Reel; Military Standard: Not; Voltage Rating (DC): 50V; Length: 1mm; Depth: 0.5mm; Width: 500um; Radiation Hardening: No; REACH SVHC: No SVHC; Lead Free: Lead Free; ComponentLink1URL: https://datasheet.ciiva.com/17178/mc-pro-17178488.pdf; ComponentLink1Description: https://datasheet.ciiva.com/17178/mc-pro-17178488.pdf; ComponentLink2URL: https://datasheet.ciiva.com/8900/mc-pro-8900138.pdf; ComponentLink2Description: https://datasheet.ciiva.com/8900/mc-pro-8900138.pdf
U5 = FSUSB42UMX: Analog Switch Single DPDT 10-Pin UMLP EP T/R; Manufacturer: ON Semiconductor / Fairchild; Min Supply Voltage: 3V; Max Supply Voltage: 4.3V; Nominal Supply Current: 1uA; Number of Inputs: 2; Number of Channels: 1; Data Rate: 480Mbps; Output Current: 100mA; Propagation Delay: 0.25ns; Bandwidth: 720MHz; Turn-Off Delay Time: 25ns; On-State Resistance: 6.5R; Turn-On Delay Time: 30ns; Supplier 1: Mouser; Manufacturer Part Number: FSUSB42UMX; Stock 1: 18559; Pricing 1: 1=0.57, 10=0.47, 50=0.47, 100=0.287, 1000=0.222, 10000=0.176 (USD); Mount: Surface Mount; Number of Pins: 10; Weight: 18.08g; Min Operating Temperature: -40°C; Max Operating Temperature: 85°C; Package Quantity: 1; Number of Outputs: 2; Packaging: Tape and Reel; Operating Supply Voltage: 4.3V; Number of Ports: 2; Termination: SMD/SMT; Throw Configuration: DPDT; Supply Type: Single; Length: 1.4mm; Height: 0.5mm; Width: 1.8mm; Radiation Hardening: No; REACH SVHC: No SVHC; Lead Free: Lead Free; ComponentLink1URL: https://datasheet.ciiva.com/15108/getdatasheetpartid-189033-15108996.pdf; ComponentLink1Description: https://datasheet.ciiva.com/15108/getdatasheetpartid-189033-15108996.pdf; ComponentLink2URL: https://datasheet.ciiva.com/1504/1815547-1504946.pdf; ComponentLink2Description: https://datasheet.ciiva.com/1504/1815547-1504946.pdf; ComponentLink3URL: https://datasheet.ciiva.com/26074/fsusb42-26074741.pdf; ComponentLink3Description: https://datasheet.ciiva.com/26074/fsusb42-26074741.pdf; ComponentLink4URL: https://datasheet.ciiva.com/1561/fsusb42-1561415.pdf; ComponentLink4Description: https://datasheet.ciiva.com/1561/fsusb42-1561415.pdf; ComponentLink5URL: https://datasheet.ciiva.com/3233/fsusb42-3233259.pdf; ComponentLink5Description: https://datasheet.ciiva.com/3233/fsusb42-3233259.pdf; ComponentLink6URL: https://datasheet.ciiva.com/6638/fsusb42-6638604.pdf; ComponentLink6Description: https://datasheet.ciiva.com/6638/fsusb42-6638604.pdf; ComponentLink7URL: https://datasheet.ciiva.com/6638/fsusb42-6638607.pdf; ComponentLink7Description: https://datasheet.ciiva.com/6638/fsusb42-6638607.pdf

## Sheet RP_ComputeModule3_rev.3.0_HDMi.SchDoc
size A4 portrait
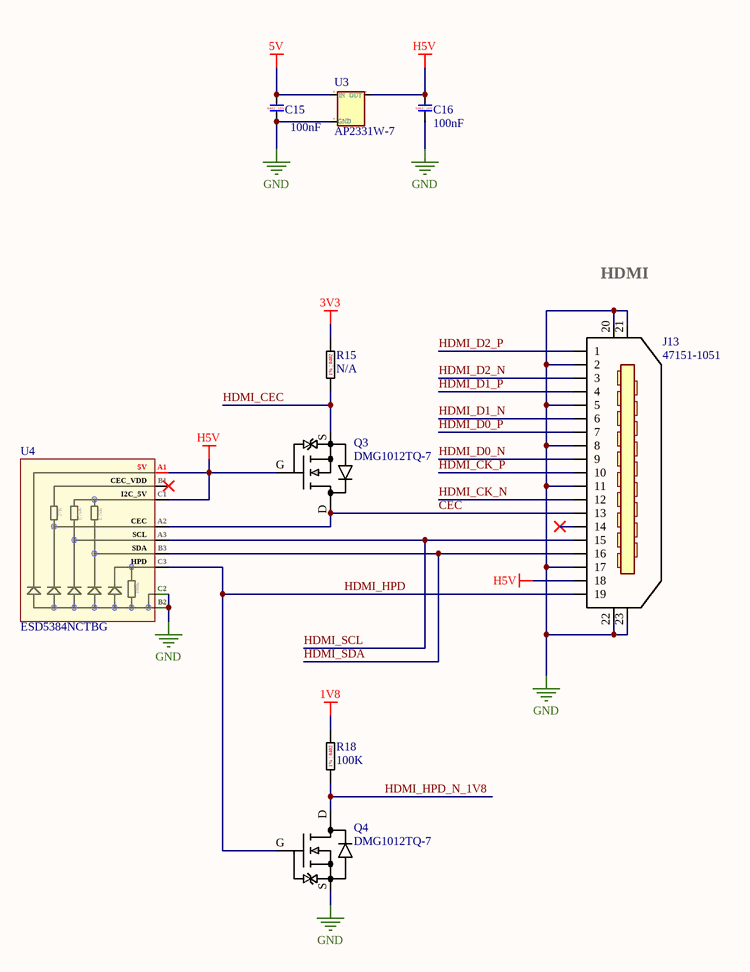
[diagram p9: RP_ComputeModule3_rev.3.0_HDMi.SchDoc]

### Parts
C15  100nF  [GJM 0402 C]
C16  100nF  [GJM 0402 C]
J13  47151-1051  [Molex 471511051 HDMi]
Q3  DMG1012TQ-7  [Diodes SOT523]
Q4  DMG1012TQ-7  [Diodes SOT523]
R15  N/A  [RES0402N/A]  (no BOM)
R18  100K  [RES0402]
U3  AP2331W-7  [DiodesInc SC59-BEC]
U4  ESD5384NCTBG  [ONSemi CSP-9]

### Nets
1V8: R18.1
3V3: R15.1
5V: C15.2 U3.IN
GND: C15.1 C16.1 J13.2 J13.5 J13.8 J13.11 J13.17 J13.20 J13.21 J13.22 J13.23 Q4.S U3.GND U4.B2 U4.C2
H5V: C16.2 J13.18 Q3.G U3.OUT U4.A1 U4.C1
CEC: J13.13 Q3.D U4.A2
HDMI_CEC: Q3.S R15.2
HDMI_CK_N: J13.12
HDMI_CK_P: J13.10
HDMI_D0_N: J13.9
HDMI_D0_P: J13.7
HDMI_D1_N: J13.6
HDMI_D1_P: J13.4
HDMI_D2_N: J13.3
HDMI_D2_P: J13.1
HDMI_HPD: J13.19 Q4.G U4.C3
HDMI_HPD_N_1V8: Q4.D R18.2
HDMI_SCL: J13.15 U4.A3
HDMI_SDA: J13.16 U4.B3

Not connected (* = marked no-connect by the designer): J13 14*; U4 B1*

### Notes on the sheet
- HDMI
- (in symbol ESD5384NCTBG) 5V; CEC_VDD; I2C_5V; 27K; 1.75K; CEC; SCL; SDA; HPD; 100K
- (in symbol GRM155R71A104JA01D) 0402 | 10V
- (in symbol Resistor_N/A) 1% | 0402
- (in symbol SG73P1ETTP1003F) 1% | 0402

### Library data of the parts
C15 C16 = GRM155R71A104JA01D: as C17 on sheet RP_ComputeModule3_rev.3.0_USB; Supplier 1: Mouser; Manufacturer Part Number: GRM155R71A104JA01D; RoHS: RoHS Compliant; Category: Multilayer Ceramic Capacitors MLCC - SMD/SMT; Stock 1: 376; Pricing 1: 1=0.100, 10=0.024, 100=0.011, 500=0.008, 1000=0.006, 5000=0.005, 10000=0.004 (USD); Capacitance: 0.1 uF; Height: 0.5 mm; Length: 1 mm; Package / Case: 0402 (1005 metric); Packaging: Cut Tape; Product: General Type MLCCs; Series: GRM; Termination Style: SMD/SMT; Tolerance: 5 %; Width: 0.5 mm; Brand: Murata Electronics; Capacitance - nF: 100 nF; Case Code - in: 0402; Case Code - mm: 1005; Maximum Operating Temperature: + 125 C; Minimum Operating Temperature: - 55 C; Standard Pack Qty: 10000; RoHS - Mouser: Y; Minimum Order Quantity: 1; Reeling: True; ComponentLink1URL: https://www.mouser.com/ds/2/281/c02e-2905.pdf; ComponentLink1Description: https://www.mouser.com/ds/2/281/c02e-2905.pdf
J13 = 47151-1051: HDMI, Displayport & DVI Connectors 1.0 HDMI RIGHT ANGLE NGLE HEADER ASSEMBLY; Manufacturer: Molex; Body Material: Thermoplastic; Gender: Female; Voltage Rating (DC): 40V; Number of Positions: 19; Current Rating: 500mA; Supplier 1: Mouser; Manufacturer Part Number: 47151-1051; Stock 1: 773; Pricing 1: 1=1.48, 10=1.39, 50=1.27, 100=1.15, 1000=0.904, 10000=0.802 (USD); Contact Plating: Gold; Contact Material: Copper Alloy; Colour: Black; Package Quantity: 1050; Packaging: Tape and Reel; Termination: SMD/SMT; Orientation: Right Angle; Number of Rows: 2; Number of Circuits: 19; REACH SVHC: No SVHC; Halogen Free: Low Halogen; ComponentLink1URL: https://datasheet.ciiva.com/5053/0471511051-io-connectors-170027-5053366.pdf; ComponentLink1Description: https://datasheet.ciiva.com/5053/0471511051-io-connectors-170027-5053366.pdf
Q3 Q4 = DMG1012TQ-7: as Q1 on sheet RP_ComputeModule3_rev.3.0_BootSelector; Supplier 1: Mouser; Manufacturer Part Number: DMG1012TQ-7; Stock 1: 11314; Pricing 1: 1=0.34, 10=0.225, 50=0.225, 100=0.094, 1000=0.064, 10000=0.043 (USD); Mount: Surface Mount; Case/Package: SOT-523; Number of Pins: 3; Min Operating Temperature: -55°C; Max Operating Temperature: 150°C; Packaging: Tape and Reel; Drain to Source Voltage (Vdss): 20V; Continuous Drain Current (ID): 630mA; ComponentLink1URL: http://www.mouser.com/ds/2/115/ds31783-892575.pdf; ComponentLink1Description: http://www.mouser.com/ds/2/115/ds31783-892575.pdf; ComponentLink2URL: https://www.diodes.com/assets/Datasheets/ds31783.pdf; ComponentLink2Description: https://www.diodes.com/assets/Datasheets/ds31783.pdf
R15 = Resistor_N/A
R18 = SG73P1ETTP1003F: as R10 on sheet RP_ComputeModule3_rev.3.0_BootSelector; Supplier 1: Mouser; Manufacturer Part Number: SG73P1ETTP1003F; Stock 1: 17094; Pricing 1: 1=0.24, 10=0.24, 50=0.053, 100=0.041, 1000=0.03, 10000=0.018 (USD); Case/Package: 0402; Case Code (Imperial): 0402; Case Code (Metric): 1005; Min Operating Temperature: -55°C; Max Operating Temperature: 155°C; Tolerance: 1%; Packaging: Tape and Reel; Termination: SMD/SMT; ComponentLink1URL: https://datasheet.ciiva.com/5567/sg73-5567782.pdf; ComponentLink1Description: https://datasheet.ciiva.com/5567/sg73-5567782.pdf
U3 = AP2331W-7: LOAD SWITCH SC59; Manufacturer: Diodes; Number of Outputs: 1; Output Current: 200mA; Max Supply Voltage: 5.2V; Min Supply Voltage: 2.7V; Interface: On/Off; On-State Resistance: 350mR; Turn-On Delay Time: 700us; Fault Protection: Over Temperature,Reverse Current; Supplier 1: Mouser; Manufacturer Part Number: AP2331W-7; Stock 1: 6726; Pricing 1: 1=0.51, 10=0.388, 50=0.388, 100=0.21, 1000=0.158, 10000=0.127 (USD); Mount: Surface Mount; Case/Package: TO-236-3; Number of Pins: 59; Min Operating Temperature: -40°C; Max Operating Temperature: 85°C; Package Quantity: 3000; Packaging: Tape and Reel; Max Output Current: 200mA; Voltage: 5.2V; Current: 200mA; Length: 3.1mm; Height: 1.3mm; Width: 1.7mm; Radiation Hardening: No; REACH SVHC: No SVHC; ComponentLink1URL: https://datasheet.ciiva.com/18567/ap2331-18567928.pdf; ComponentLink1Description: https://datasheet.ciiva.com/18567/ap2331-18567928.pdf; ComponentLink2URL: https://datasheet.ciiva.com/18567/ap2331-18567929.pdf; ComponentLink2Description: https://datasheet.ciiva.com/18567/ap2331-18567929.pdf; ComponentLink3URL: https://datasheet.ciiva.com/18567/ap2331-18567930.pdf; ComponentLink3Description: https://datasheet.ciiva.com/18567/ap2331-18567930.pdf
U4 = ESD5384NCTBG: TVS DIODE 3VWM 9WLCSP; Manufacturer: ON Semiconductor; Capacitance: 29pF; Direction: Unidirectional; Number of Unidirectional Channels: 5; Reverse Standoff Voltage: 3V; Min Breakdown Voltage: 6V; Power Line Protection: No; ESD Protection: Yes; Max Reverse Leakage Current: 200nA; Supplier 1: Mouser; Manufacturer Part Number: ESD5384NCTBG; Stock 1: 9540; Pricing 1: 1=0.44, 10=0.362, 50=0.362, 100=0.221, 1000=0.171, 10000=0.136 (USD); Number of Pins: 9; Min Operating Temperature: -30°C; Max Operating Temperature: 85°C; Package Quantity: 5000; Packaging: Tape and Reel; Number of Lines: 5; Length: 1.14mm; Height: 0.63mm; Width: 1.14mm; Depth: 1.14mm; Radiation Hardening: No; Lead Free: Lead Free; Halogen Free: Halogen Free; ComponentLink1URL: https://datasheet.ciiva.com/11195/esd5384-d-11195286.pdf; ComponentLink1Description: https://datasheet.ciiva.com/11195/esd5384-d-11195286.pdf; ComponentLink2URL: https://datasheet.ciiva.com/12545/esd5384-d-119513-12545067.pdf; ComponentLink2Description: https://datasheet.ciiva.com/12545/esd5384-d-119513-12545067.pdf; ComponentLink3URL: https://datasheet.ciiva.com/354/esd5384-d-354168.pdf; ComponentLink3Description: https://datasheet.ciiva.com/354/esd5384-d-354168.pdf

## Nets that join several sheets
1V8: RP_ComputeModule3_rev.3.0_POWER (7 pins), RP_ComputeModule3_rev.3.0_Headers (8 pins), RP_ComputeModule3_rev.3.0_BootSelector (R10.1), RP_ComputeModule3_rev.3.0_HDMi (R18.1)
3V3: RP_ComputeModule3_rev.3.0_POWER (12 pins), RP_ComputeModule3_rev.3.0_uSDCard (C24.2 J16.4), RP_ComputeModule3_rev.3.0_Headers (8 pins), RP_ComputeModule3_rev.3.0_BootSelector (R9.1), RP_ComputeModule3_rev.3.0_Displays (8 pins), RP_ComputeModule3_rev.3.0_USB (C17.1 R20.2 U5.9), RP_ComputeModule3_rev.3.0_HDMi (R15.1)
5V: RP_ComputeModule3_rev.3.0_POWER (9 pins), RP_ComputeModule3_rev.3.0_Headers (J5.4 J5.56 J6.4 J6.56), RP_ComputeModule3_rev.3.0_USB (R19.1), RP_ComputeModule3_rev.3.0_HDMi (C15.2 U3.IN)
GND: RP_ComputeModule3_rev.3.0_GPIOs (R26.2 R27.2 R28.2 R29.2), RP_ComputeModule3_rev.3.0_POWER (90 pins), RP_ComputeModule3_rev.3.0_uSDCard (6 pins), RP_ComputeModule3_rev.3.0_Headers (34 pins), RP_ComputeModule3_rev.3.0_BootSelector (J4.1 Q2.S R30.2), RP_ComputeModule3_rev.3.0_Displays (40 pins), RP_ComputeModule3_rev.3.0_Mechanics (J1.G1 J1.G2 J1.G3 J1.G4), RP_ComputeModule3_rev.3.0_USB (17 pins), RP_ComputeModule3_rev.3.0_HDMi (15 pins)
VBUSB: RP_ComputeModule3_rev.3.0_BootSelector (J4.3), RP_ComputeModule3_rev.3.0_USB (J15.5 Q5.G R21.1)
VG0: RP_ComputeModule3_rev.3.0_POWER (J3.3 R7.1), RP_ComputeModule3_rev.3.0_Headers (J5.16 J5.28 J5.40 J5.52)
VG1: RP_ComputeModule3_rev.3.0_POWER (J3.4 R8.1), RP_ComputeModule3_rev.3.0_Headers (J6.16 J6.28 J6.40 J6.52)
CAM0_IO0: RP_ComputeModule3_rev.3.0_Headers (J6.51), RP_ComputeModule3_rev.3.0_Displays (J9.17)
CAM0_IO1: RP_ComputeModule3_rev.3.0_Headers (J6.49), RP_ComputeModule3_rev.3.0_Displays (J9.18)
CAM1_IO0: RP_ComputeModule3_rev.3.0_Headers (J6.43), RP_ComputeModule3_rev.3.0_Displays (J11.17)
CAM1_IO1: RP_ComputeModule3_rev.3.0_Headers (J6.41), RP_ComputeModule3_rev.3.0_Displays (J11.18)
CD0_SCL: RP_ComputeModule3_rev.3.0_Headers (J6.47), RP_ComputeModule3_rev.3.0_Displays (J9.20 J10.20 R13.2)
CD0_SDA: RP_ComputeModule3_rev.3.0_Headers (J6.45), RP_ComputeModule3_rev.3.0_Displays (J9.21 J10.21 R14.2)
CD1_SCL: RP_ComputeModule3_rev.3.0_Headers (J6.39), RP_ComputeModule3_rev.3.0_Displays (J11.20 J12.20 R16.2)
CD1_SDA: RP_ComputeModule3_rev.3.0_Headers (J6.37), RP_ComputeModule3_rev.3.0_Displays (J11.21 J12.21 R17.2)
EMMC_DISABLE_N: RP_ComputeModule3_rev.3.0_GPIOs (J1.2), RP_ComputeModule3_rev.3.0_BootSelector (Q1.D)
EMMC_EN_N_1V8: RP_ComputeModule3_rev.3.0_GPIOs (J1.90), RP_ComputeModule3_rev.3.0_BootSelector (Q2.G R10.2)
GPIO0: RP_ComputeModule3_rev.3.0_GPIOs (J1.3), RP_ComputeModule3_rev.3.0_Headers (J5.1)
GPIO1: RP_ComputeModule3_rev.3.0_GPIOs (J1.5), RP_ComputeModule3_rev.3.0_Headers (J5.3)
GPIO2: RP_ComputeModule3_rev.3.0_GPIOs (J1.9), RP_ComputeModule3_rev.3.0_Headers (J5.5)
GPIO3: RP_ComputeModule3_rev.3.0_GPIOs (J1.11), RP_ComputeModule3_rev.3.0_Headers (J5.7)
GPIO4: RP_ComputeModule3_rev.3.0_GPIOs (J1.15), RP_ComputeModule3_rev.3.0_Headers (J5.9)
GPIO5: RP_ComputeModule3_rev.3.0_GPIOs (J1.17), RP_ComputeModule3_rev.3.0_Headers (J5.11)
GPIO6: RP_ComputeModule3_rev.3.0_GPIOs (J1.21), RP_ComputeModule3_rev.3.0_Headers (J5.13)
GPIO7: RP_ComputeModule3_rev.3.0_GPIOs (J1.23), RP_ComputeModule3_rev.3.0_Headers (J5.15)
GPIO8: RP_ComputeModule3_rev.3.0_GPIOs (J1.27), RP_ComputeModule3_rev.3.0_Headers (J5.17)
GPIO9: RP_ComputeModule3_rev.3.0_GPIOs (J1.29), RP_ComputeModule3_rev.3.0_Headers (J5.19)
GPIO10: RP_ComputeModule3_rev.3.0_GPIOs (J1.33), RP_ComputeModule3_rev.3.0_Headers (J5.21)
GPIO11: RP_ComputeModule3_rev.3.0_GPIOs (J1.35), RP_ComputeModule3_rev.3.0_Headers (J5.23)
GPIO12: RP_ComputeModule3_rev.3.0_GPIOs (J1.45), RP_ComputeModule3_rev.3.0_Headers (J5.25)
GPIO13: RP_ComputeModule3_rev.3.0_GPIOs (J1.47), RP_ComputeModule3_rev.3.0_Headers (J5.27)
GPIO14: RP_ComputeModule3_rev.3.0_GPIOs (J1.51), RP_ComputeModule3_rev.3.0_Headers (J5.29)
GPIO15: RP_ComputeModule3_rev.3.0_GPIOs (J1.53), RP_ComputeModule3_rev.3.0_Headers (J5.31)
GPIO16: RP_ComputeModule3_rev.3.0_GPIOs (J1.57), RP_ComputeModule3_rev.3.0_Headers (J5.33)
GPIO17: RP_ComputeModule3_rev.3.0_GPIOs (J1.59), RP_ComputeModule3_rev.3.0_Headers (J5.35)
GPIO18: RP_ComputeModule3_rev.3.0_GPIOs (J1.63), RP_ComputeModule3_rev.3.0_Headers (J5.37)
GPIO19: RP_ComputeModule3_rev.3.0_GPIOs (J1.65), RP_ComputeModule3_rev.3.0_Headers (J5.39)
GPIO20: RP_ComputeModule3_rev.3.0_GPIOs (J1.69), RP_ComputeModule3_rev.3.0_Headers (J5.41)
GPIO21: RP_ComputeModule3_rev.3.0_GPIOs (J1.71), RP_ComputeModule3_rev.3.0_Headers (J5.43)
GPIO22: RP_ComputeModule3_rev.3.0_GPIOs (J1.75), RP_ComputeModule3_rev.3.0_Headers (J5.45)
GPIO23: RP_ComputeModule3_rev.3.0_GPIOs (J1.77), RP_ComputeModule3_rev.3.0_Headers (J5.47)
GPIO24: RP_ComputeModule3_rev.3.0_GPIOs (J1.81), RP_ComputeModule3_rev.3.0_Headers (J5.49)
GPIO25: RP_ComputeModule3_rev.3.0_GPIOs (J1.83), RP_ComputeModule3_rev.3.0_Headers (J5.51)
GPIO26: RP_ComputeModule3_rev.3.0_GPIOs (J1.87), RP_ComputeModule3_rev.3.0_Headers (J5.53)
GPIO27: RP_ComputeModule3_rev.3.0_GPIOs (J1.89), RP_ComputeModule3_rev.3.0_Headers (J5.55)
GPIO28: RP_ComputeModule3_rev.3.0_GPIOs (J1.28 R27.1), RP_ComputeModule3_rev.3.0_Headers (J6.1)
GPIO29: RP_ComputeModule3_rev.3.0_GPIOs (J1.30 R26.1), RP_ComputeModule3_rev.3.0_Headers (J6.3)
GPIO30: RP_ComputeModule3_rev.3.0_GPIOs (J1.34), RP_ComputeModule3_rev.3.0_Headers (J6.5)
GPIO31: RP_ComputeModule3_rev.3.0_GPIOs (J1.36), RP_ComputeModule3_rev.3.0_Headers (J6.7)
GPIO32: RP_ComputeModule3_rev.3.0_GPIOs (J1.46), RP_ComputeModule3_rev.3.0_Headers (J6.9)
GPIO33: RP_ComputeModule3_rev.3.0_GPIOs (J1.48), RP_ComputeModule3_rev.3.0_Headers (J6.11)
GPIO34: RP_ComputeModule3_rev.3.0_GPIOs (J1.52), RP_ComputeModule3_rev.3.0_Headers (J6.13)
GPIO35: RP_ComputeModule3_rev.3.0_GPIOs (J1.54), RP_ComputeModule3_rev.3.0_Headers (J6.15)
GPIO36: RP_ComputeModule3_rev.3.0_GPIOs (J1.58), RP_ComputeModule3_rev.3.0_Headers (J6.17)
GPIO37: RP_ComputeModule3_rev.3.0_GPIOs (J1.60), RP_ComputeModule3_rev.3.0_Headers (J6.19)
GPIO38: RP_ComputeModule3_rev.3.0_GPIOs (J1.64), RP_ComputeModule3_rev.3.0_Headers (J6.21)
GPIO39: RP_ComputeModule3_rev.3.0_GPIOs (J1.66), RP_ComputeModule3_rev.3.0_Headers (J6.23)
GPIO40: RP_ComputeModule3_rev.3.0_GPIOs (J1.70), RP_ComputeModule3_rev.3.0_Headers (J6.25)
GPIO41: RP_ComputeModule3_rev.3.0_GPIOs (J1.72), RP_ComputeModule3_rev.3.0_Headers (J6.27)
GPIO42: RP_ComputeModule3_rev.3.0_GPIOs (J1.76), RP_ComputeModule3_rev.3.0_Headers (J6.29)
GPIO43: RP_ComputeModule3_rev.3.0_GPIOs (J1.78), RP_ComputeModule3_rev.3.0_Headers (J6.31)
GPIO44: RP_ComputeModule3_rev.3.0_GPIOs (J1.82 R29.1), RP_ComputeModule3_rev.3.0_Headers (J6.33)
GPIO45: RP_ComputeModule3_rev.3.0_GPIOs (J1.84 R28.1), RP_ComputeModule3_rev.3.0_Headers (J6.35)
HDMI_CEC: RP_ComputeModule3_rev.3.0_Displays (J1.171), RP_ComputeModule3_rev.3.0_HDMi (Q3.S R15.2)
HDMI_CK_N: RP_ComputeModule3_rev.3.0_Displays (J1.111), RP_ComputeModule3_rev.3.0_HDMi (J13.12)
HDMI_CK_P: RP_ComputeModule3_rev.3.0_Displays (J1.113), RP_ComputeModule3_rev.3.0_HDMi (J13.10)
HDMI_D0_N: RP_ComputeModule3_rev.3.0_Displays (J1.117), RP_ComputeModule3_rev.3.0_HDMi (J13.9)
HDMI_D0_P: RP_ComputeModule3_rev.3.0_Displays (J1.119), RP_ComputeModule3_rev.3.0_HDMi (J13.7)
HDMI_D1_N: RP_ComputeModule3_rev.3.0_Displays (J1.123), RP_ComputeModule3_rev.3.0_HDMi (J13.6)
HDMI_D1_P: RP_ComputeModule3_rev.3.0_Displays (J1.125), RP_ComputeModule3_rev.3.0_HDMi (J13.4)
HDMI_D2_N: RP_ComputeModule3_rev.3.0_Displays (J1.129), RP_ComputeModule3_rev.3.0_HDMi (J13.3)
HDMI_D2_P: RP_ComputeModule3_rev.3.0_Displays (J1.131), RP_ComputeModule3_rev.3.0_HDMi (J13.1)
HDMI_HPD_N_1V8: RP_ComputeModule3_rev.3.0_Displays (J1.88), RP_ComputeModule3_rev.3.0_HDMi (Q4.D R18.2)
HDMI_SCL: RP_ComputeModule3_rev.3.0_Displays (J1.175), RP_ComputeModule3_rev.3.0_HDMi (J13.15 U4.A3)
HDMI_SDA: RP_ComputeModule3_rev.3.0_Displays (J1.173), RP_ComputeModule3_rev.3.0_HDMi (J13.16 U4.B3)
RUN: RP_ComputeModule3_rev.3.0_GPIOs (J1.177), RP_ComputeModule3_rev.3.0_Headers (J5.57), RP_ComputeModule3_rev.3.0_Displays (J7.1)
SDX_CLK: RP_ComputeModule3_rev.3.0_GPIOs (J1.10), RP_ComputeModule3_rev.3.0_uSDCard (J16.5)
SDX_CMD: RP_ComputeModule3_rev.3.0_GPIOs (J1.12), RP_ComputeModule3_rev.3.0_uSDCard (J16.3)
SDX_D0: RP_ComputeModule3_rev.3.0_GPIOs (J1.16), RP_ComputeModule3_rev.3.0_uSDCard (J16.7)
SDX_D1: RP_ComputeModule3_rev.3.0_GPIOs (J1.18), RP_ComputeModule3_rev.3.0_uSDCard (J16.8)
SDX_D2: RP_ComputeModule3_rev.3.0_GPIOs (J1.22), RP_ComputeModule3_rev.3.0_uSDCard (J16.1)
SDX_D3: RP_ComputeModule3_rev.3.0_GPIOs (J1.24), RP_ComputeModule3_rev.3.0_uSDCard (J16.2)
TVDAC: RP_ComputeModule3_rev.3.0_Headers (J6.59), RP_ComputeModule3_rev.3.0_Displays (J1.166)
USB_OTGID: RP_ComputeModule3_rev.3.0_Headers (J6.55 R12.1), RP_ComputeModule3_rev.3.0_USB (J1.168)
VC_TCK: RP_ComputeModule3_rev.3.0_GPIOs (J1.180), RP_ComputeModule3_rev.3.0_Displays (J7.8)
VC_TDI: RP_ComputeModule3_rev.3.0_GPIOs (J1.174), RP_ComputeModule3_rev.3.0_Displays (J7.3)
VC_TDO: RP_ComputeModule3_rev.3.0_GPIOs (J1.178), RP_ComputeModule3_rev.3.0_Displays (J7.5)
VC_TMS: RP_ComputeModule3_rev.3.0_GPIOs (J1.176), RP_ComputeModule3_rev.3.0_Displays (J7.6)
VC_TRST_N: RP_ComputeModule3_rev.3.0_GPIOs (J1.172), RP_ComputeModule3_rev.3.0_Displays (J7.2)
VDD_CORE: RP_ComputeModule3_rev.3.0_POWER (J1.179), RP_ComputeModule3_rev.3.0_Headers (J6.53)